# EAGLE design atmega_breakout (EAGLE 6.5.0)
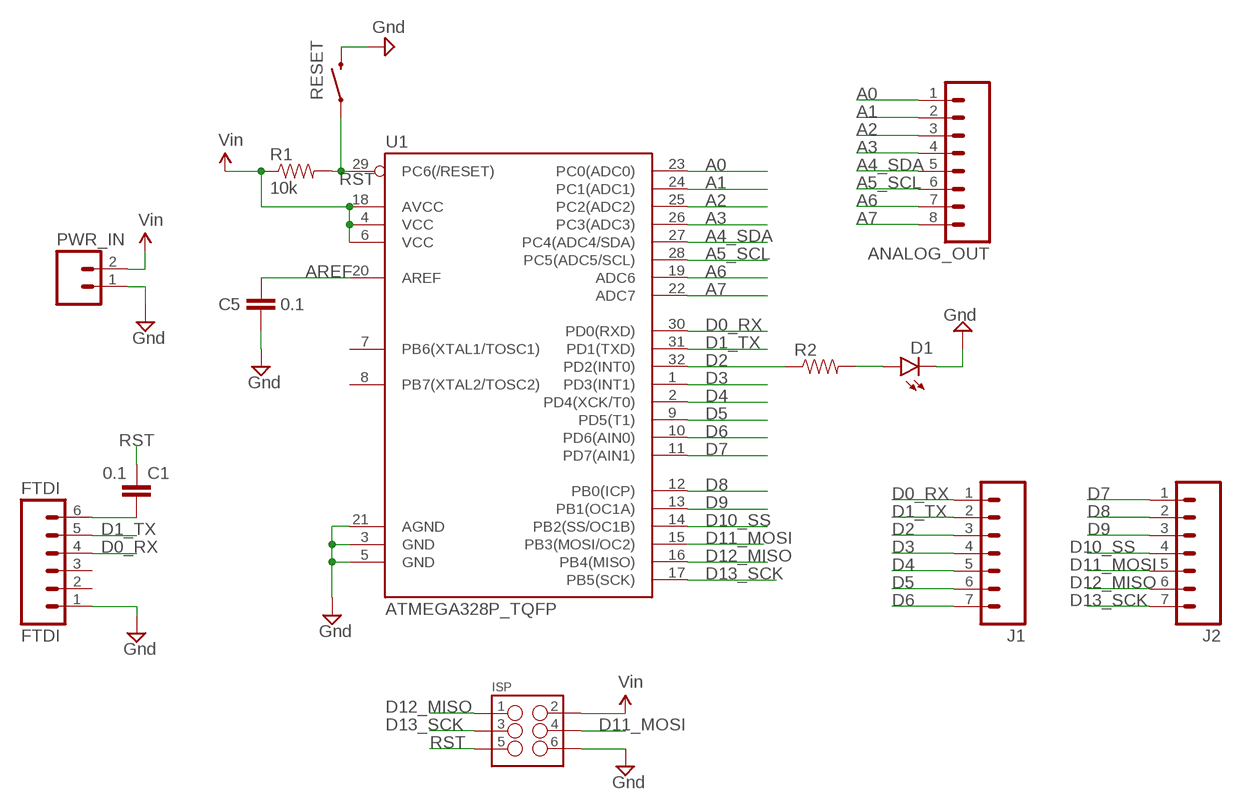
[diagram p0: schematic, sheet 1]

## Parts
ANALOG_OUT  M08  [1X08_ROUND]
C1  0.1  CAP1206  [1206]
C5  0.1  CAP1206  [1206]
D1  LED1206  [LED-1206]
FTDI  FTDI  M06SIP  [1X06]
ISP  M03X22X3_SILK_MALE_PTH  [2X3]
J1  M07  [1X07]
J2  M07  [1X07]
PWR_IN  M02PTH  [1X02]
R1  10k  RESISTOR1206  [1206]
R2  RESISTOR1206  [1206]
RESET  SWITCH-MOMENTARY-2SMD  [TACTILE-SWITCH-SMD]
U1  ATMEGA328P_TQFP  [TQFP32-08]

## Nets
A0: ANALOG_OUT.1 U1.23(PC0(ADC0))
A1: ANALOG_OUT.2 U1.24(PC1(ADC1))
A2: ANALOG_OUT.3 U1.25(PC2(ADC2))
A3: ANALOG_OUT.4 U1.26(PC3(ADC3))
A4_SDA: ANALOG_OUT.5 U1.27(PC4(ADC4/SDA))
A5_SCL: ANALOG_OUT.6 U1.28(PC5(ADC5/SCL))
A6: ANALOG_OUT.7 U1.19(ADC6)
A7: ANALOG_OUT.8 U1.22(ADC7)
AREF: C5.1 U1.20(AREF)
D0_RX: FTDI.4 J1.1 U1.30(PD0(RXD))
D1_TX: FTDI.5 J1.2 U1.31(PD1(TXD))
D2: J1.3 R2.1 U1.32(PD2(INT0))
D3: J1.4 U1.1(PD3(INT1))
D4: J1.5 U1.2(PD4(XCK/T0))
D5: J1.6 U1.9(PD5(T1))
D6: J1.7 U1.10(PD6(AIN0))
D7: J2.1 U1.11(PD7(AIN1))
D8: J2.2 U1.12(PB0(ICP))
D9: J2.3 U1.13(PB1(OC1A))
D10_SS: J2.4 U1.14(PB2(SS/OC1B))
D11_MOSI: ISP.4 J2.5 U1.15(PB3(MOSI/OC2))
D12_MISO: ISP.1 J2.6 U1.16(PB4(MISO))
D13_SCK: ISP.3 J2.7 U1.17(PB5(SCK))
GND [power]: C5.2 D1.C FTDI.1 ISP.6 PWR_IN.1 RESET.3 U1.3(GND) U1.5(GND) U1.21(AGND) ; supply symbol labelled Gnd
N$1: D1.A R2.2
N$20: C1.2 FTDI.6
RST: C1.1 ISP.5 R1.2 RESET.1 U1.29(PC6(/RESET))
VCC: ISP.2 PWR_IN.2 R1.1 U1.4(VCC) U1.6(VCC) U1.18(AVCC) ; supply symbol labelled Vin
Unconnected: FTDI.2 FTDI.3 U1.7(PB6(XTAL1/TOSC1)) U1.8(PB7(XTAL2/TOSC2))

## Library data of the parts
ANALOG_OUT = SparkFun-Connectors:M08: Header 8 Standard 8-pin 0.1" header. Use with straight break away headers (SKU : PRT-00116), right angle break away headers (PRT-00553), swiss pins (PRT-00743), machine pins (PRT-00117), and female headers (PRT-00115).; PROD_ID: CONN-08437
C1 = SparkFun-Passives:CAP: Capacitor Standard 0603 ceramic capacitor, and 0.1" leaded capacitor.
C5 = SparkFun-Capacitors:CAP: Capacitor Standard 0603 ceramic capacitor, and 0.1" leaded capacitor.
D1 = SparkFun-LED:LED: LEDs Standard schematic elements and footprints for 5mm, 3mm, 1206, and 0603 sized LEDs. 5mm - Spark Fun Electronics SKU : COM-00529 (and others)
FTDI = SparkFun-Connectors:M06: Header 6 Standard 6-pin 0.1" header. Use with straight break away headers (SKU : PRT-00116), right angle break away headers (PRT-00553), swiss pins (PRT-00743), machine pins (PRT-00117), and female headers (PRT-00115). Molex polarized connector foot print use with SKU : PRT-08094 with associated crimp pins and housings. NOTES ON THE VARIANTS LOCK and LOCK_LONGPADS... This footprint was designed to help hold the alignment of a through-hole component (i.e. 6-pin header) while soldering it into place. You may notice that each hole has been shifted either up or down by 0.005 of an inch from it's more standard position (which is a perfectly straight line). This slight alteration caused the pins (the squares in the middle) to touch the edges of the holes. Because they are alternating, it causes a "brace" to hold the component in place. 0.005 has proven to be the perfect amount of "off-center" position when using our standard breakaway headers. Although looks a little odd when you look at the bare footprint, once you have a header in there, the alteration is very hard to notice. Also, if you push a header all the way into place, it is covered up entirely on the bottom side. This idea of altering the position of holes to aid alignment will be further integrated into the Sparkfun Library for other footprints. It can help hold any component with 3 or more connection pins.
ISP = SparkFun-Connectors:M03X2: 2x3 .1" header. Shrouded, with keying- CONN-10681 SMT- CONN-11415 Pogo pins- HW-11044; PROD_ID: CONN-09701
J1 J2 = SparkFun-Connectors:M07: Header 7 Standard 7-pin 0.1" header. Use with straight break away headers (SKU : PRT-00116), right angle break away headers (PRT-00553), swiss pins (PRT-00743), machine pins (PRT-00117), and female headers (PRT-00115). NOTES ON THE VARIANTS LOCK and LOCK_LONGPADS... This footprint was designed to help hold the alignment of a through-hole component (i.e. 7-pin header) while soldering it into place. You may notice that each hole has been shifted either up or down by 0.005 of an inch from it's more standard position (which is usually a perfectly straight line). This slight alteration caused the pins (the squares in the middle) to touch the edges of the holes. Because they are alternating, it causes a "brace" to hold the header in place. 0.005 has proven to be the perfect amount of "off-center" position when using our standard breakaway headers. Although looks a little odd when you look at the bare footprint, once you have a header in there, the alteration is very hard to notice. Also, if you push a header all the way into place, it is covered up entirely on the bottom side. This idea of altering the position of holes to aid alignment will be further integrated into the Sparkfun Library for other footprints. It can help hold any component with 3 or more connection pins.
PWR_IN = SparkFun-Connectors:M02: Standard 2-pin 0.1" header. Use with - straight break away headers ( PRT-00116) - right angle break away headers (PRT-00553) - swiss pins (PRT-00743) - machine pins (PRT-00117) - female headers (PRT-00115) Molex polarized connector foot print use with: PRT-08233 with associated crimp pins and housings. 2.54_SCREWTERM for use with PRT-10571. 3.5mm Screw Terminal footprints for PRT-08084 5mm Screw Terminal footprints for use with PRT-08432
R1 R2 = SparkFun-Resistors:RESISTOR: Resistor Basic schematic elements and footprints for 0603, 1206, and PTH resistors.
RESET = SparkFun-Electromechanical:SWITCH-MOMENTARY-2: Various NO switches- pushbuttons, reed, etc; PROD_ID: SWCH-08247
U1 = SparkFun-DigitalIC:ATMEGA328P_TQFP; PROD_ID: IC-09069

## Net classes
1 power: width 0.381 mm, clearance 0.254 mm

## Board
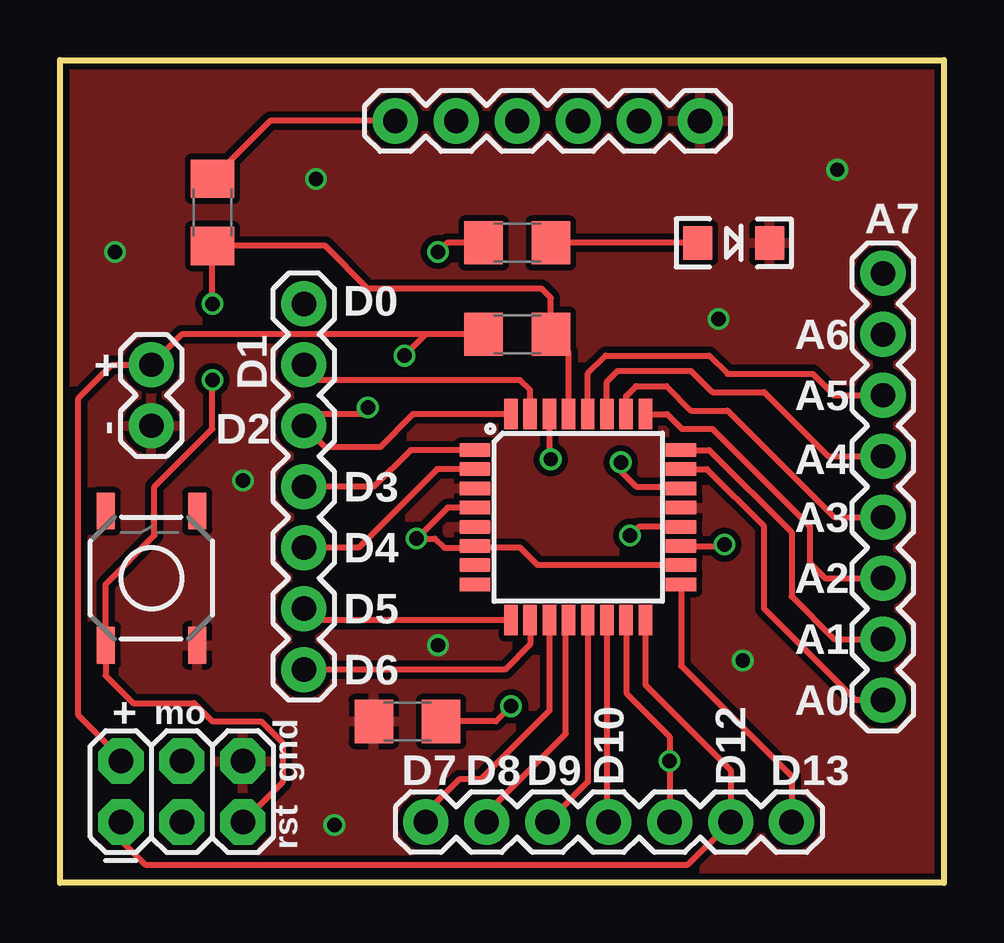
[diagram p1: board, top side]
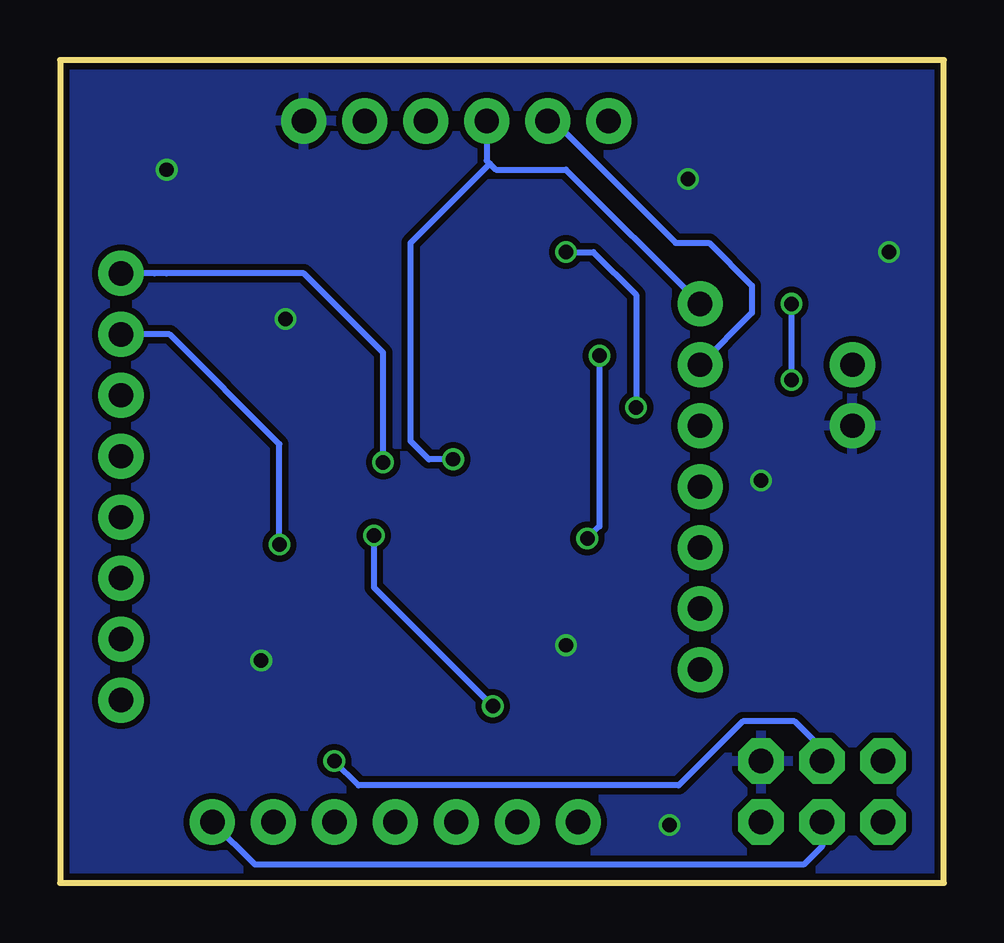
[diagram p2: board, bottom side, seen from below]

Size 36.83 x 34.29 mm. Coordinates in mm from the lower left corner, seen from the top.
Outline: 0,0 0,34.29 36.83,34.29 36.83,0 0,0
Copper layers (1*16): Top 0.035mm / dielectric 1.5mm / Bottom 0.035mm
Design rules "SparkFun *": minimum track width 6mil, minimum drill 20mil, track to track 6mil, track to pad 6mil, pad to pad 6mil, via to via 6mil, smd to smd 6mil, copper to edge 6mil, drill to drill 6mil, minimum pad ring 6mil, minimum via ring 6mil, stop-mask expansion 4mil, vias tented up to drill 25mil, thermal gap 10mil

### Footprints (pad centres in the part's own frame; a part is rotated, then mirrored left to right if it is on the bottom)
1X08_ROUND = drill 1.016 pad 1.88: 1 0,0; 2 2.54,0; 3 5.08,0; 4 7.62,0; 5 10.16,0; 6 12.7,0; 7 15.24,0; 8 17.78,0
1206 = smd 1.6 x 1.8: 1 -1.4,0; 2 1.4,0
LED-1206 = smd 1.2 x 1.4: A -1.5,0; C 1.5,0
1X06 = drill 1.016 pad 1.88: 1 0,0; 2 2.54,0; 3 5.08,0; 4 7.62,0; 5 10.16,0; 6 12.7,0
2X3 = drill 1.016 pad 1.88 octagon: 1 0,0; 2 0,2.54; 3 2.54,0; 4 2.54,2.54; 5 5.08,0; 6 5.08,2.54
1X07 = drill 1.016 pad 1.88: 1 0,0; 2 2.54,0; 3 5.08,0; 4 7.62,0; 5 10.16,0; 6 12.7,0; 7 15.24,0
1X02 = drill 1.016 pad 1.88: 1 0,0; 2 2.54,0
TACTILE-SWITCH-SMD = smd 1.524 x 0.762: 1 -2.794,1.905; 2 2.794,1.905; 3 -2.794,-1.905; 4 2.794,-1.905
TQFP32-08 = smd 1.27 x 0.559: 1 -4.293,2.8; 2 -4.293,2; 3 -4.293,1.2; 4 -4.293,0.4; 5 -4.293,-0.4; 6 -4.293,-1.2; 7 -4.293,-2; 8 -4.293,-2.8; 17 4.293,-2.8; 18 4.293,-2; 19 4.293,-1.2; 20 4.293,-0.4; 21 4.293,0.4; 22 4.293,1.2; 23 4.293,2; 24 4.293,2.8 | smd 0.559 x 1.27: 9 -2.8,-4.293; 10 -2,-4.293; 11 -1.2,-4.293; 12 -0.4,-4.293; 13 0.4,-4.293; 14 1.2,-4.293; 15 2,-4.293; 16 2.8,-4.293; 25 2.8,4.293; 26 2,4.293; 27 1.2,4.293; 28 0.4,4.293; 29 -0.4,4.293; 30 -1.2,4.293; 31 -2,4.293; 32 -2.8,4.293

### Placement (x,y rotation side)
ANALOG_OUT  34.29,7.62 90 top
C1  6.35,27.94 90 top
C5  14.48,6.73 180 top
D1  28.07,26.67 0 top
FTDI  26.67,31.75 180 top
ISP  2.54,2.54 0 top
J1  10.16,24.13 270 top
J2  15.24,2.54 0 top
PWR_IN  3.81,19.05 90 top
R1  19.05,22.86 0 top
R2  19.05,26.67 0 top
RESET  3.81,12.7 90 top
U1  21.59,15.24 0 top

### Tracks (layer width: path | path; a pad name or v marks a point on that pad's centre or on a via)
A0
  Top 0.254: U1.23 26.96,17.24 29.34,14.86 29.34,11.43 33.15,7.62 ANALOG_OUT.1
A1
  Top 0.254: U1.24 27.05,18.04 30.48,14.61 30.48,11.94 32.26,10.16 ANALOG_OUT.2
A2
  Top 0.254: U1.25 25.3,19.53 25.91,18.92 27.18,18.92 31.24,14.86 31.24,13.34 31.88,12.7 ANALOG_OUT.3
A3
  Top 0.254: U1.26 23.59,20.29 24,20.7 25.27,20.7 26.29,19.68 27.81,19.68 32.26,15.24 ANALOG_OUT.4
A4_SDA
  Top 0.254: U1.27 22.79,20.89 23.24,21.34 26.29,21.34 27.18,20.45 29.34,20.45 32,17.78 ANALOG_OUT.5
A5_SCL
  Top 0.254: U1.28 21.99,21.23 22.73,21.97 27.05,21.97 27.81,21.21 31.37,21.21 32.26,20.32 ANALOG_OUT.6
A6  (via drill 0.6)
  Top 0.254: U1.19 27.63,14.04 v27.69,14.1
  Bottom 0.254: v27.69,14.1 27.69,18.29 32.26,22.86 ANALOG_OUT.7
A7  (via drill 0.6)
  Top 0.254: v23.37,17.53 23.37,17.14 24,16.51 25.81,16.51 U1.22
  Bottom 0.254: ANALOG_OUT.8 32.89,25.4 32.38,25.4 26.67,25.4 23.37,22.1 v23.37,17.53
AREF  (via drill 0.6)
  Top 0.254: U1.20 24.11,14.84 v23.75,14.48 | v18.8,7.37 18.16,6.73 C5.1
  Bottom 0.254: v23.75,14.48 23.75,12.32 v18.8,7.37
D0_RX  (via drill 0.6)
  Top 0.254: U1.30 20.39,17.71 v20.45,17.65
  Bottom 0.254: FTDI.4 19.05,30.1 18.92,29.97 | 18.92,29.97 18.67,29.72 15.75,29.72 J1.1 | v20.45,17.65 21.46,17.65 22.23,18.41 22.23,26.67 18.92,29.97
D1_TX
  Top 0.254: U1.31 19.59,20.54 19.18,20.95 10.79,20.95 J1.2
  Bottom 0.254: FTDI.5 16.26,31.75 11.18,26.67 9.78,26.67 8,24.89 8,23.75 J1.2
D2  (via drill 0.6)
  Top 0.254: R2.1 16.13,26.67 v15.75,26.29 | v12.83,19.81 12.83,19.53 10.64,19.53 J1.3 11.05,18.16 13.34,18.16 14.71,19.53 U1.32
  Bottom 0.254: v15.75,26.29 14.61,26.29 12.83,24.51 v12.83,19.81
D3
  Top 0.254: U1.1 14.61,18.04 13.08,16.51 J1.4
D4
  Top 0.254: U1.2 15.72,17.24 12.45,13.97 J1.5
D5
  Top 0.254: U1.9 10.64,10.95 J1.6
D6
  Top 0.254: U1.10 19.59,9.94 18.54,8.89 J1.7
D7
  Top 0.254: U1.11 20.39,7.18 17.53,4.32 16.64,4.32 15.24,2.92 J2.1
D8
  Top 0.254: J2.2 17.78,2.92 21.08,6.22 21.08,10.84 U1.12
D9
  Top 0.254: U1.13 21.99,4.21 J2.3
D10_SS
  Top 0.254: U1.14 22.79,2.61 J2.4
D11_MOSI  (via drill 0.6)
  Top 0.254: J2.5 v25.4,5.08 25.4,6.1 23.62,7.87 23.62,10.91 U1.15
  Bottom 0.254: ISP.4 5.08,5.59 6.22,6.73 8.38,6.73 11.05,4.06 24.38,4.06 v25.4,5.08
D12_MISO
  Top 0.254: U1.16 24.39,8.25 27.94,4.7 J2.6 26.16,0.76 3.56,0.76 2.54,1.78 ISP.1
D13_SCK
  Top 0.254: U1.17 25.88,9.04 30.48,4.45 J2.7
  Bottom 0.254: ISP.3 5.08,1.52 5.84,0.76 28.7,0.76 J2.7
GND  (via drill 0.6)
  other vias: 7.62,16.76 15.75,9.91 28.45,9.27 27.43,23.5 10.67,29.34 2.29,26.29 11.43,2.41 32.38,29.72
  pour Bottom (isolate 0.254): 0,34.29 36.83,34.29 36.83,0 0,0
  pour Top (isolate 0.254): 0,34.29 36.83,34.29 36.83,0 0,0
N$1
  Top 0.254: D1.A R2.2
N$20
  Top 0.254: FTDI.6 8.76,31.75 C1.2
RST  (via drill 0.6)
  Top 0.254: U1.29 21.19,22.12 R1.2 20.45,24.38 20.07,24.77 12.83,24.77 11.05,26.54 C1.1 v6.35,24.13 | ISP.5 9.27,4.19 9.27,5.84 8.38,6.73 6.35,6.73 5.59,7.49 3.05,7.49 1.91,8.64 RESET.1 1.91,12.45 3.94,14.48 3.94,16.51 6.35,18.92 v6.35,20.95
  Bottom 0.254: v6.35,20.95 v6.35,24.13
VCC  (via drill 0.6)
  Top 0.254: U1.18 19.91,13.24 19.18,13.97 17.37,13.97 U1.6 17.23,13.97 16,13.97 15.62,14.35 v14.86,14.35 16.15,15.64 U1.4 | ISP.2 2.54,5.21 0.76,6.99 0.76,20.19 2.16,21.59 PWR_IN.2 5.08,22.86 R1.1 15.24,22.86 v14.35,21.97
  Bottom 0.254: v14.35,21.97 14.35,14.86 v14.86,14.35

### Text on the board
tPlace: A7 | D0 | D1 | A6 | + | A5 | - | D2 | A4 | D3 | A3 | D4 | A2 | D5 | A1 | mo | D6 | A0 | + | gnd | D7 | D8 | D9 | D10 | D12 | D13 | rst